# EAGLE schematic AFM_piezo_controller (EAGLE 9.6.2)

## Parts
U1  SOP65P640X120-16N  [SOP65P640X120-16N]  (not placed on a sheet)
U2  SOP65P640X120-16N  [SOP65P640X120-16N]  (not placed on a sheet)
U3  SOP65P640X120-16N  [SOP65P640X120-16N]  (not placed on a sheet)
U4  SOP65P640X120-16N  [SOP65P640X120-16N]  (not placed on a sheet)
U5  SOP65P640X120-16N  [SOP65P640X120-16N]  (not placed on a sheet)

## Library data of the parts
U1-U5 = SOP65P640X120-16N:SOP65P640X120-16N; A1_MIN: 0.05; A_MAX: 1.2; A_MIN: 1.2; A_NOM: 1.2; B_MAX: 0.3; B_MIN: 0.19; B_NOM: 0.245; D2_MAX: 0.0; D_MAX: 5.1; D_MIN: 4.9; D_NOM: 5.0; E1_MAX: 4.5; E1_MIN: 4.3; E1_NOM: 4.4; E2_MAX: 0.0; ENOM: 0.65; E_MAX: 6.4; E_MIN: 6.4; E_NOM: 6.4; L_MAX: 0.75; L_MIN: 0.45; L_NOM: 0.6; MANUFACTURER: Analog Devices; PIN_COUNT: 16.0; SNAPEDA_PACKAGE_ID: 105572; STANDARD: IPC 7351B